# EAGLE design timer_v1 (EAGLE 7.3.0)
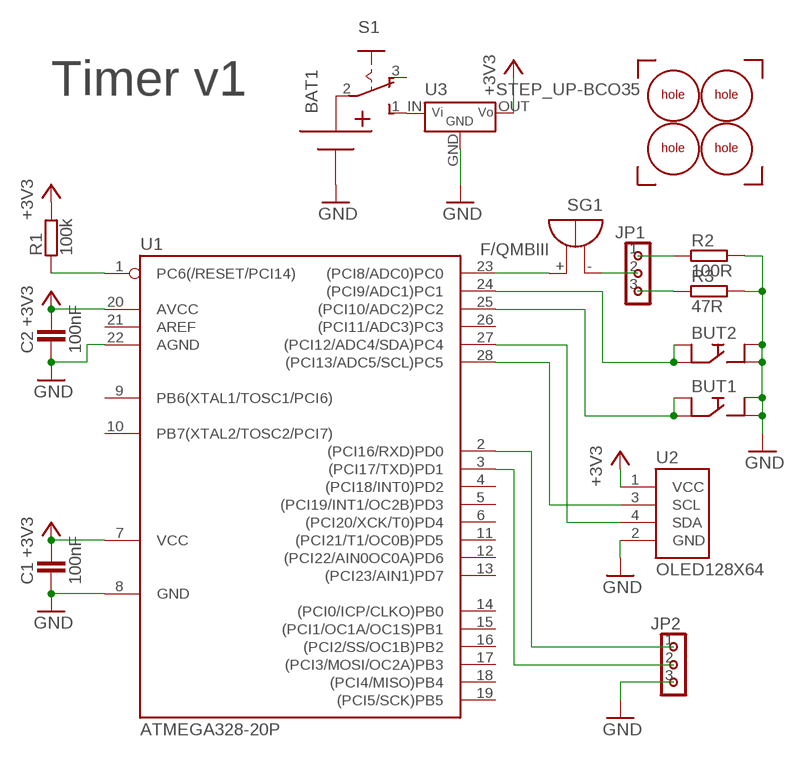
[diagram p0: schematic, sheet 1]

## Parts
BAT1  BATTERY_1X'DOUBLE_SIDE'  [1XAA_BATTERY_HOLDER_2]
BUT1  BUTTON'THT'  [BUTTON]
BUT2  BUTTON'THT'  [BUTTON]
C1  100nF  C-CERAMIC'SMD'  [C0805]
C2  100nF  C-CERAMIC'SMD'  [C0805]
JP1  PINHD-3X1  [PINHD-3X1]
JP2  PINHD-3X1  [PINHD-3X1]
R1  100k  R'2'  [R0805]
R2  100R  R'2'  [R0805]
R3  47R  R'2'  [R0805]
S1  255SB  [SLIDE_SWITCH]
SG1  F/QMBIII  [F/QMBIII]
U1  ATMEGA328-20P  [DIL28-3]
U2  OLED128X64  [OLED128X64]
U3  STEP_UP-BCO35  [BCO35]
U$1  CORNER  [CORNER]
U$2  HOLE  [HOLE]
U$3  HOLE  [HOLE]
U$4  HOLE  [HOLE]
U$5  HOLE  [HOLE]
U$6  CORNER  [CORNER]
U$7  CORNER  [CORNER]
U$8  CORNER  [CORNER]

## Nets
+3V3: C1.2 C2.2 R1.2 U1.7(VCC) U1.20(AVCC) U2.1(VCC) U3.OUT(VOUT)
GND: BAT1.N BUT1.1 BUT1.3 BUT2.1 BUT2.3 C1.1 C2.1 JP2.3 R2.2 R3.2 U1.8(GND) U1.22(AGND) U2.2(GND) U3.GND
N$1: BAT1.P S1.2(MIDDLE)
N$2: S1.1(S) U3.IN(VIN)
N$3: R1.1 U1.1(PC6(/RESET/PCI14))
N$4: U1.27((PCI12/ADC4/SDA)PC4) U2.4(SDA)
N$5: U1.28((PCI13/ADC5/SCL)PC5) U2.3(SCL)
N$6: BUT1.2 BUT1.4 U1.25((PCI10/ADC2)PC2)
N$7: BUT2.2 BUT2.4 U1.24((PCI9/ADC1)PC1)
N$8: JP1.2 SG1.-(+)
N$9: JP1.1 R2.1
N$10: JP1.3 R3.1
N$11: SG1.+(-) U1.23((PCI8/ADC0)PC0)
N$12: JP2.1 U1.2((PCI16/RXD)PD0)
N$13: JP2.2 U1.3((PCI17/TXD)PD1)
Unconnected: S1.3(O) U1.4((PCI18/INT0)PD2) U1.5((PCI19/INT1/OC2B)PD3) U1.6((PCI20/XCK/T0)PD4) U1.9(PB6(XTAL1/TOSC1/PCI6)) U1.10(PB7(XTAL2/TOSC2/PCI7)) U1.11((PCI21/T1/OC0B)PD5) U1.12((PCI22/AIN0OC0A)PD6) U1.13((PCI23/AIN1)PD7) U1.14((PCI0/ICP/CLKO)PB0) U1.15((PCI1/OC1A/OC1S)PB1) U1.16((PCI2/SS/OC1B)PB2) U1.17((PCI3/MOSI/OC2A)PB3) U1.18((PCI4/MISO)PB4) U1.19((PCI5/SCK)PB5) U1.21(AREF) U1.26((PCI11/ADC3)PC3)

## Notes on the sheet
- Timer v1

## Library data of the parts
BAT1 = 1_domaci:BATTERY_1X
BUT1 BUT2 = 1_domaci:BUTTON
C1 C2 = 1_domaci:C-CERAMIC
JP1 JP2 = 1_domaci:PINHD-3X1
R1-R3 = 1_domaci:R
S1 = 1_domaci:255SB: SLIDING SWITCH Distributor Buerklin, 11G810
SG1 = buzzer:F/QMBIII: BUZZER Source: Buerklin; OC_FARNELL: unknown; OC_NEWARK: unknown
U1 = 1_domaci:ATMEGA328*P: MICROCONTROLLER 32 kBytes FLASH 2 kBytes SRAM 1 kBytes EEPROM USART 8-channel 10 bit ADC
U2 = 1_domaci:OLED128X64
U3 = 1_domaci:STEP_UP-BCO35
U$1 U$6-U$8 = 1_domaci:CORNER
U$2-U$5 = 1_domaci:HOLE

## Board
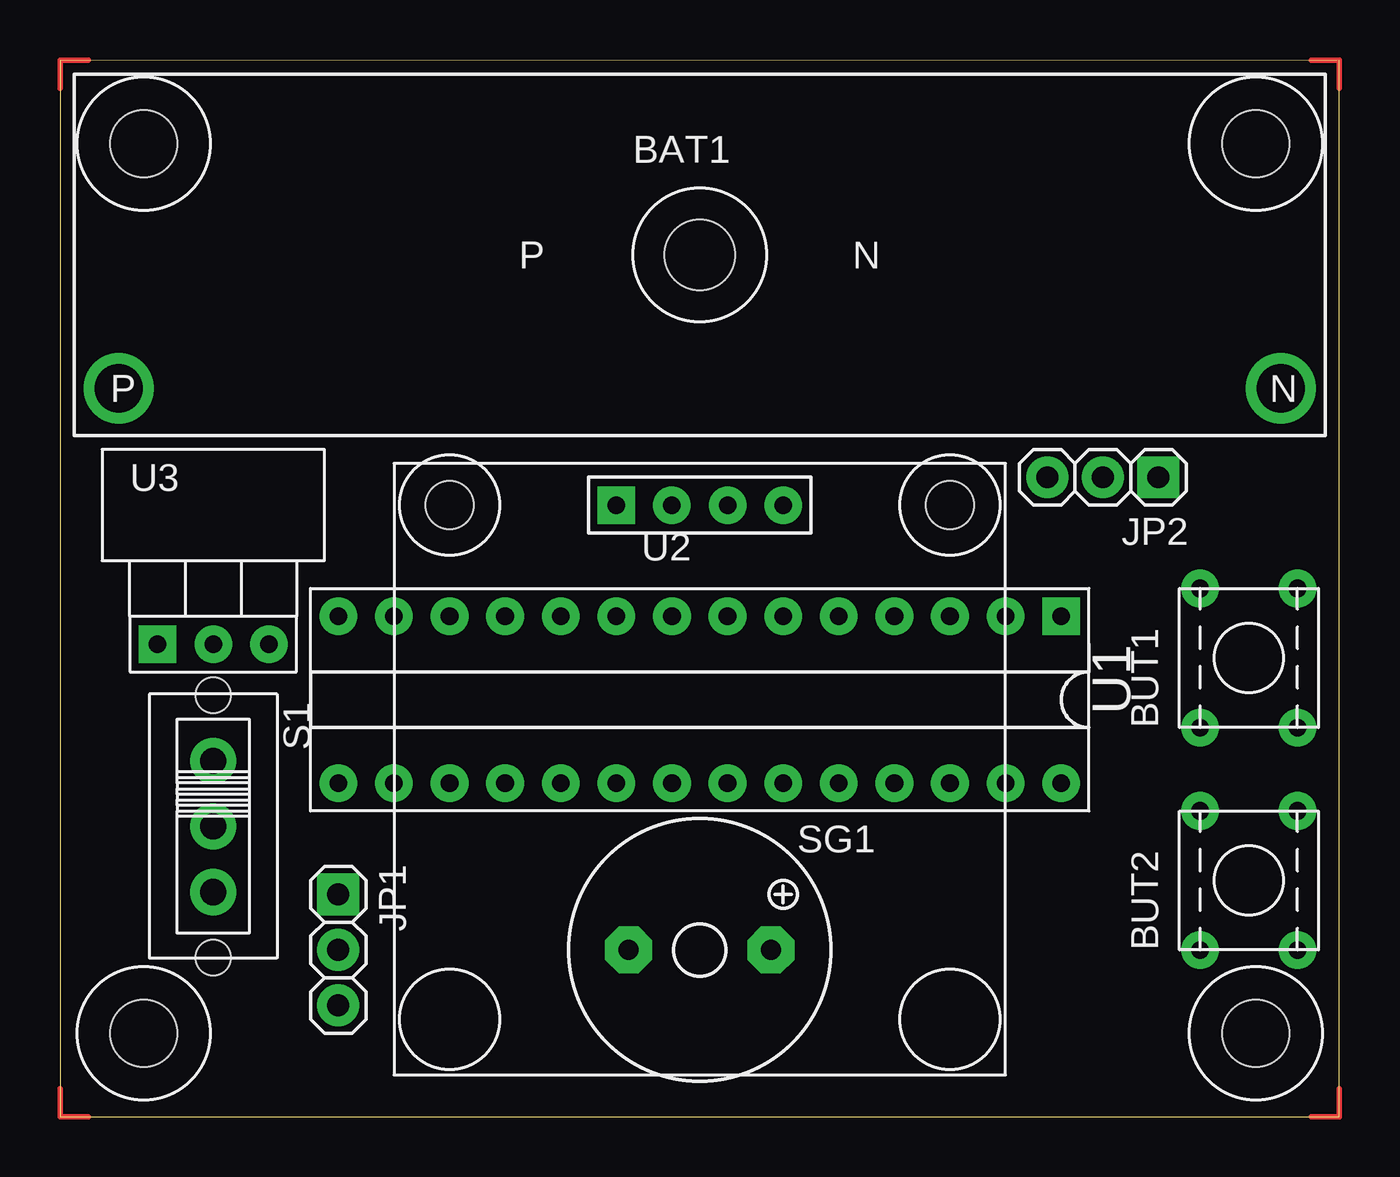
[diagram p1: board, top side]
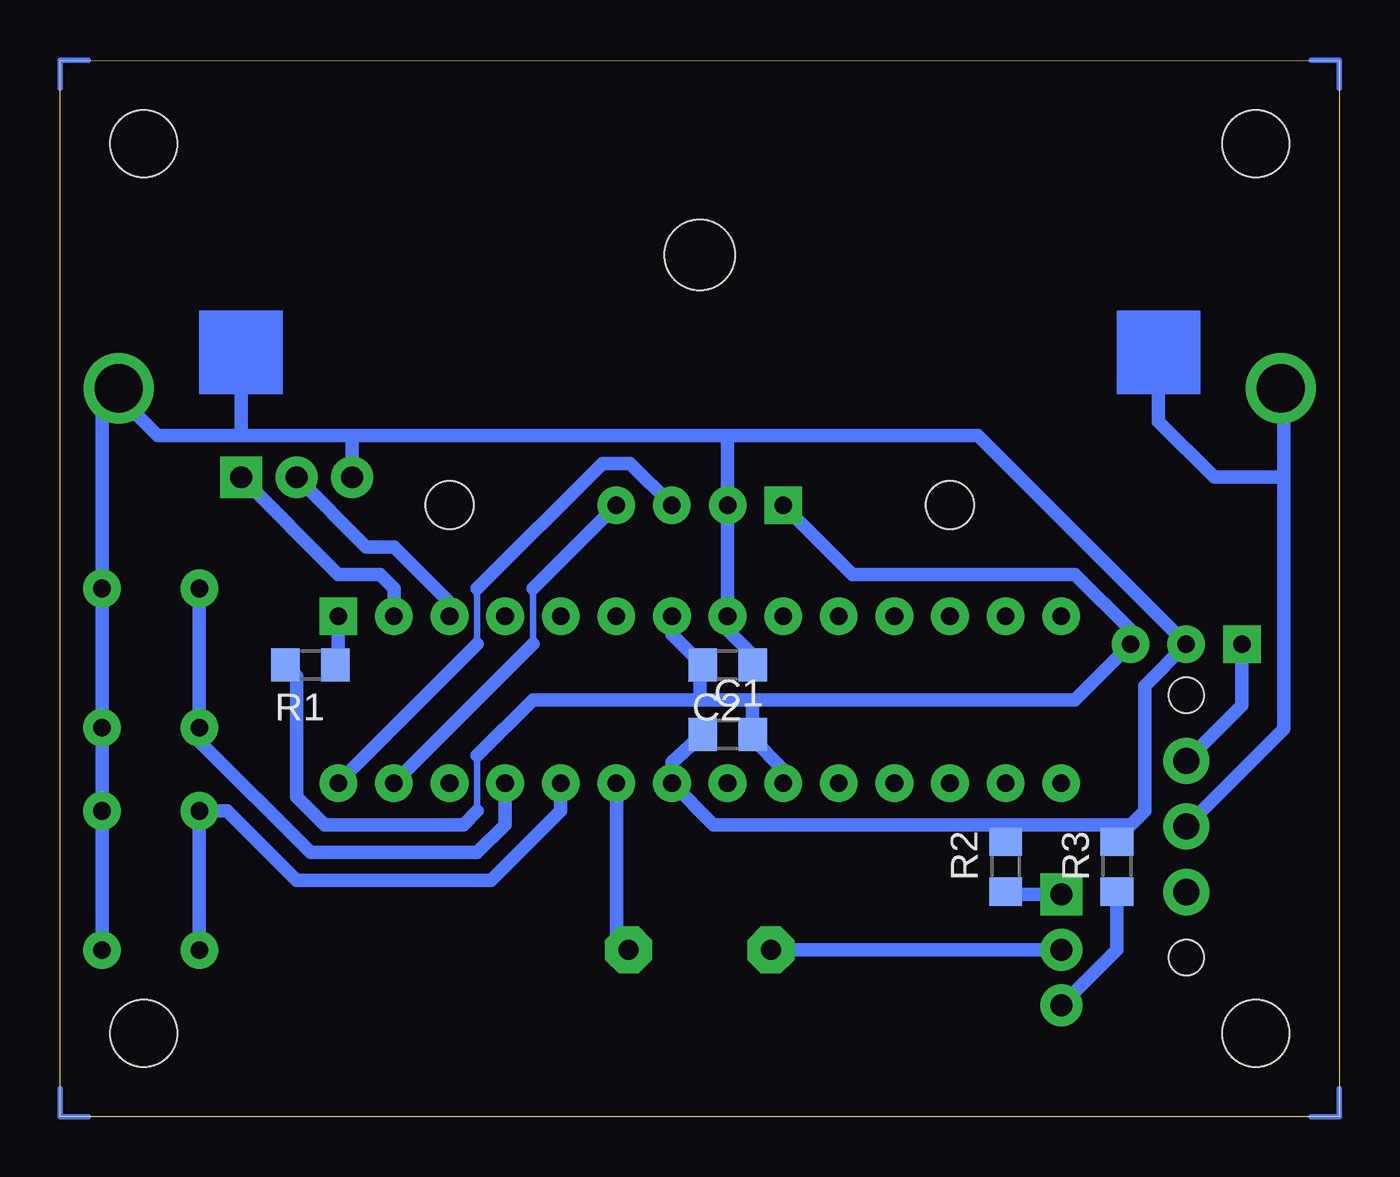
[diagram p2: board, bottom side, seen from below]

Size 58.42 x 48.26 mm. Coordinates in mm from the lower left corner, seen from the top.
Outline: 0,0 58.42,0 58.42,48.26 0,48.25 0,0
Copper layers (1*16): Top 0.035mm / dielectric 1.5mm / Bottom 0.035mm
Design rules "default *": minimum track width 10mil, minimum drill 24mil, track to track 8mil, track to pad 8mil, pad to pad 8mil, via to via 8mil, smd to smd 8mil, copper to edge 40mil, drill to drill 8mil, minimum pad ring 18mil, minimum via ring 8mil, stop-mask expansion 4mil, vias tented up to drill 0mil, thermal gap 10mil

### Footprints (pad centres in the part's own frame; a part is rotated, then mirrored left to right if it is on the bottom)
1XAA_BATTERY_HOLDER_2 = drill 2.2: N 26.543,-6.096; P -26.543,-6.096 | hole 3.2: 0,0
BUTTON = drill 0.8 pad 1.676: 1 -2.54,-2.54; 2 -2.54,1.905; 3 3.81,-2.54; 4 3.81,1.905
C0805 = smd 1.3 x 1.5: 1 -1.143,0; 2 1.143,0
PINHD-3X1 = drill 1 pad 1.676 square: 1 -2.54,0 | drill 1 pad 1.676: 2 0,0; 3 2.54,0
R0805 = smd 1.3 x 1.5: 1 -1.143,0; 2 1.143,0
SLIDE_SWITCH = drill 1.2: 1 -2.921,0; 2 0.076,0; 3 3.073,0 | hole 1.6: 6.071,0; -5.918,0
F/QMBIII = drill 0.914 pad 2.159 octagon: + 3.251,0; - -3.251,0
DIL28-3 = drill 0.813 square: 1 -16.51,-3.81 | drill 0.813: 2 -13.97,-3.81; 3 -11.43,-3.81; 4 -8.89,-3.81; 5 -6.35,-3.81; 6 -3.81,-3.81; 7 -1.27,-3.81; 8 1.27,-3.81; 9 3.81,-3.81; 10 6.35,-3.81; 11 8.89,-3.81; 12 11.43,-3.81; 13 13.97,-3.81; 14 16.51,-3.81; 15 16.51,3.81; 16 13.97,3.81; 17 11.43,3.81; 18 8.89,3.81; 19 6.35,3.81; 20 3.81,3.81; 21 1.27,3.81; 22 -1.27,3.81; 23 -3.81,3.81; 24 -6.35,3.81; 25 -8.89,3.81; 26 -11.43,3.81; 27 -13.97,3.81; 28 -16.51,3.81
OLED128X64 = drill 0.8 square: 1 -3.81,0 | drill 0.8: 2 -1.27,0; 3 1.27,0; 4 3.81,0 | hole 2.2: -11.43,0; 11.43,0
BCO35 = drill 0.8: GND 0,0; OUT 2.54,0 | drill 0.8 square: IN -2.54,0
HOLE = hole 3.048: 0,0

### Placement (x,y rotation side)
BAT1  29.21,39.37 0 top
BUT1  53.98,20.32 90 top
BUT2  53.98,10.16 90 top
C1  27.94,17.46 0 bottom
C2  27.94,20.64 180 bottom
JP1  12.7,7.62 270 top
JP2  47.62,29.21 180 top
R1  46.99,20.64 180 bottom
R2  15.24,11.43 90 bottom
R3  10.16,11.43 90 bottom
S1  6.99,13.34 270 top
SG1  29.21,7.62 0 top
U1  29.21,19.05 180 top
U2  29.21,27.94 0 top
U3  6.99,21.59 0 top
U$1  0.64,47.62 270 top
U$2  3.81,44.45 0 top
U$3  54.61,44.45 0 top
U$4  54.61,3.81 0 top
U$5  3.81,3.81 0 top
U$6  0.64,0.64 0 top
U$7  57.78,0.64 90 top
U$8  57.78,47.62 180 top

### Tracks (layer width: path | path; a pad name or v marks a point on that pad's centre or on a via)
+3V3
  Bottom 0.305: 39.37,16.51 39.37,13.97
  Bottom 0.61: 26.67,19.05 12.06,19.05 U3.OUT 9.53,22.23 12.06,24.77 22.23,24.77 U2.1 | 26.67,19.05 26.8,18.92 C1.2 26.8,17.27 25.4,15.88 U1.20 | U1.7 30.48,22.04 C2.2 29.21,20.51 29.21,19.05 | 26.67,19.05 29.21,19.05 | 29.21,19.05 36.83,19.05 39.37,16.51 | 39.37,13.97 40.01,13.34 46.35,13.34 47.62,14.61 47.62,20.13 R1.2
GND
  Bottom 0.61: BUT2.1 BUT2.3 BUT1.1 BUT1.3 56.52,32.51 56.39,32.51 55.88,33.02 | 50.16,31.11 53.98,31.11 55.88,33.02 | 50.16,31.11 45.09,31.11 | 45.09,31.11 27.94,31.11 | 27.94,31.11 U2.2 U1.8 27.94,22.23 26.8,21.08 C2.1 | 15.24,13.34 28.57,13.34 U1.22 30.48,16.19 C1.1 | 15.24,13.34 10.16,13.34 | 10.16,13.34 9.53,13.34 8.89,13.97 8.89,19.68 U3.GND 16.51,31.11 27.94,31.11 | R2.2 15.24,13.34 | BAT1.N 55.75,33.15 55.88,33.02 | JP2.3 45.09,31.11 | R3.2 10.16,13.34 | 50.16,31.11 50.16,34.92
N$1
  Bottom 0.61: BAT1.P 2.54,33.15 2.54,29.21 | 2.54,29.21 2.54,17.7 S1.2 | 2.54,29.21 5.71,29.21 8.26,31.75 8.26,34.92
N$2
  Bottom 0.61: U3.IN 4.45,18.8 S1.1
N$3
  Bottom 0.61: U1.1 45.72,21.27 R1.1
N$4
  Bottom 0.305: 36.83,24.13 36.83,21.59
  Bottom 0.61: U2.4 36.83,24.13 | 36.83,21.59 U1.27
N$5
  Bottom 0.305: 39.37,24.13 39.37,21.59
  Bottom 0.61: U2.3 32.38,29.84 33.66,29.84 39.37,24.13 | 39.37,21.59 U1.28
N$6
  Bottom 0.61: BUT1.4 BUT1.2 52.07,17.14 46.99,12.06 39.37,12.06 38.1,13.34 U1.25
N$7
  Bottom 0.61: BUT2.2 BUT2.4 50.8,13.97 47.62,10.79 38.73,10.79 35.56,13.97 U1.24
N$8
  Bottom 0.61: JP1.2 SG1.-
N$9
  Bottom 0.61: JP1.1 14.92,10.16 R2.1
N$10
  Bottom 0.61: JP1.3 10.16,7.62 R3.1
N$11
  Bottom 0.61: U1.23 33.02,8.26 SG1.+
N$12
  Bottom 0.61: U1.2 43.18,24.13 43.81,24.77 45.72,24.77 JP2.1
N$13
  Bottom 0.61: U1.3 40.64,23.5 43.18,26.04 43.81,26.04 44.45,26.04 JP2.2
(copper drawn outside any net)
  shapes: Bottom area x2